# Altium schematic sheet SY8303AIC1_SY8303AIC.schdoc
size 127 x 99 mm
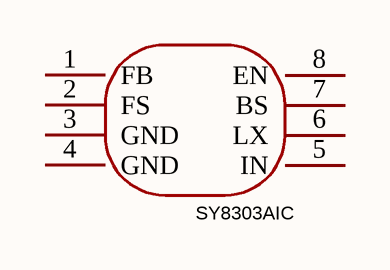
[diagram p0: SY8303AIC1_SY8303AIC.schdoc]

## Parts
U?  SY8303AIC  [TSOT-23-8_L2.9-W1.6-P0.65-LS2.8-BR]

## Nets

Not connected (* = marked no-connect by the designer): U? 1(FB) 2(FS) 3(GND) 4(GND) 5(IN) 6(LX) 7(BS) 8(EN)

## Library data of the parts
U? = SY8303AIC: Manufacturer: silergy(矽力杰); Add into BOM: yes; Function: Step-down type; Switch tube (built-in/external): 内置; Symbol: SY8303AIC; Device: SY8303AIC; LCSC Part Name: SY8303AIC; Supplier Part: C97054; Manufacturer Part: SY8303AIC; Supplier Footprint: TSOT-23-8; JLCPCB Part Class: Extended Part; Datasheet: https://atta.szlcsc.com/upload/public/pdf/source/20170308/1488958431714.pdf; Supplier: LCSC; Convert to PCB: yes; Input Voltage: -; Output Current (Max): -; Switching Frequency: -; Synchronous Rectification: -; Number of Outputs: -; Topology: -